# EAGLE design header (EAGLE 5.11)
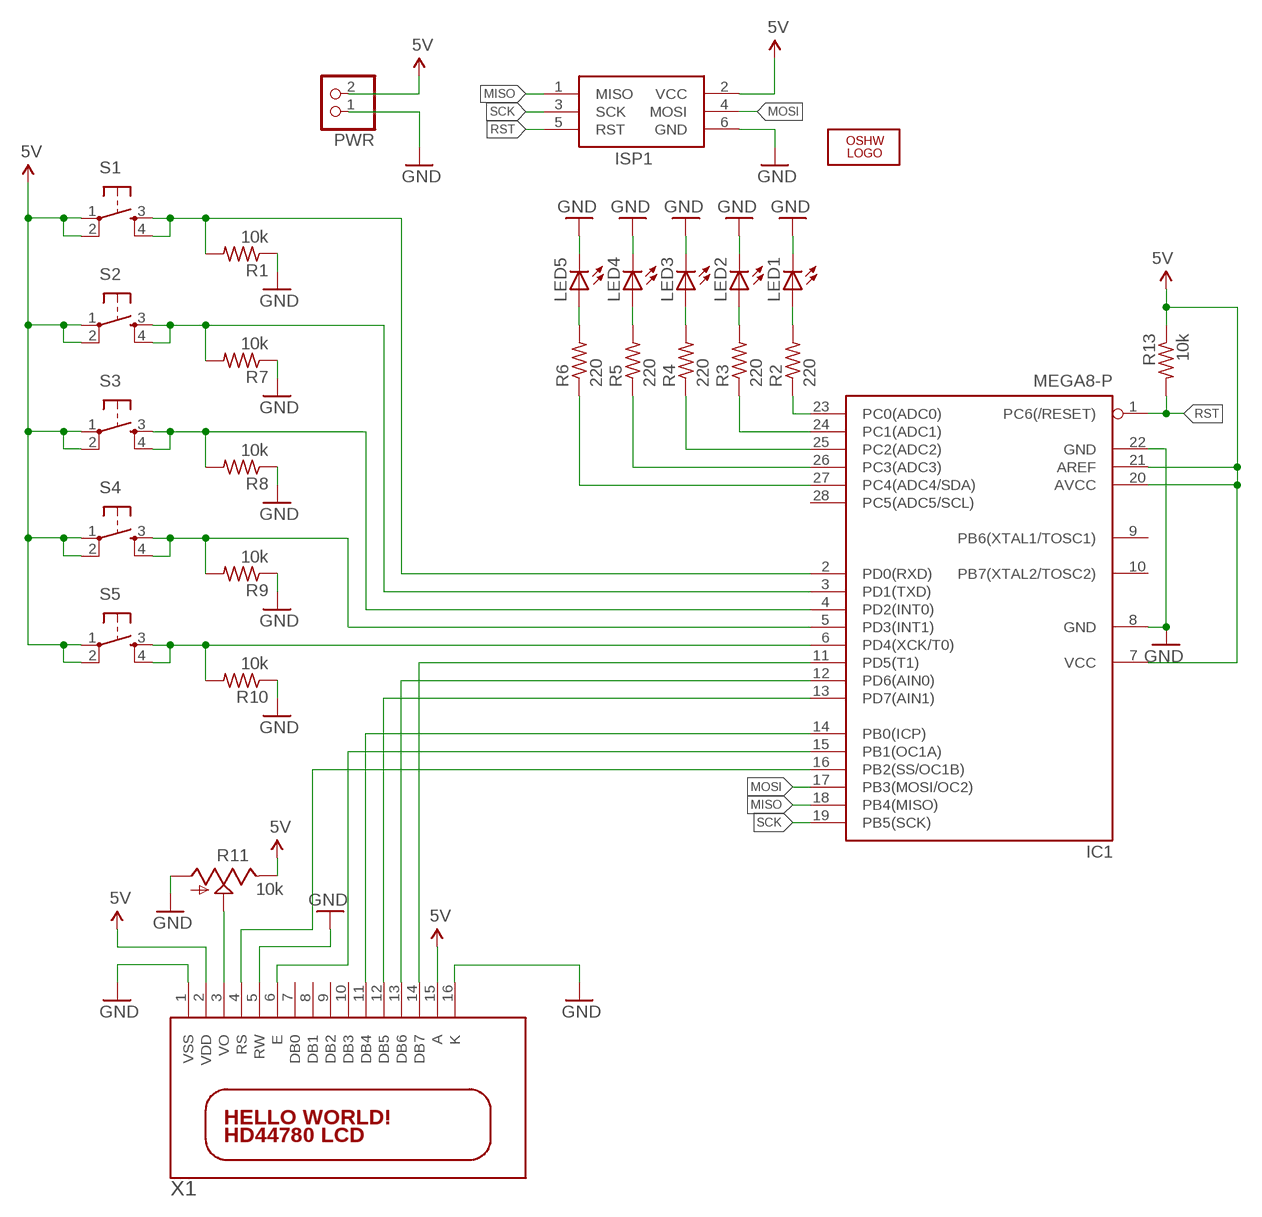
[diagram p0: schematic, sheet 1]

## Parts
IC1  MEGA8-P  [DIL28-3]
ISP1  AVRISP-6  [AVRISP]
LED1  LED5MM  [LED5MM]
LED2  LED5MM  [LED5MM]
LED3  LED5MM  [LED5MM]
LED4  LED5MM  [LED5MM]
LED5  LED5MM  [LED5MM]
LOGO1  OSHW_LOGO_10MILX0350-NT  [OSHW_10X350_NOTEXT]
PWR  PINHD-1X2/90  [1X02/90]
R1  10k  R-US_0207/7  [0207/7]
R2  220  R-US_0207/7  [0207/7]
R3  220  R-US_0207/7  [0207/7]
R4  220  R-US_0207/7  [0207/7]
R5  220  R-US_0207/7  [0207/7]
R6  220  R-US_0207/7  [0207/7]
R7  10k  R-US_0207/7  [0207/7]
R8  10k  R-US_0207/7  [0207/7]
R9  10k  R-US_0207/7  [0207/7]
R10  10k  R-US_0207/7  [0207/7]
R11  10k  TRIM_US-RS3  [RS3]
R13  10k  R-US_0207/7  [0207/7]
S1  TAC_SWITCHSMD  [TACTILE_SWITCH_SMD]
S2  TAC_SWITCHSMD  [TACTILE_SWITCH_SMD]
S3  TAC_SWITCHSMD  [TACTILE_SWITCH_SMD]
S4  TAC_SWITCHSMD  [TACTILE_SWITCH_SMD]
S5  TAC_SWITCHSMD  [TACTILE_SWITCH_SMD]
X1  HD44780LCD-1602  [LCD1602]

## Nets
5V: IC1.7(VCC) IC1.20(AVCC) IC1.21(AREF) ISP1.2(VCC) PWR.2 R11.E R13.1 S1.1 S1.2 S2.1 S2.2 S3.1 S3.2 S4.1 S4.2 S5.1 S5.2 X1.2(VDD) X1.15(A)
GND [gnd]: IC1.8(GND) IC1.22(GND) ISP1.6(GND) LED1.K(C) LED2.K(C) LED3.K(C) LED4.K(C) LED5.K(C) PWR.1 R1.1 R7.1 R8.1 R9.1 R10.1 R11.A X1.1(VSS) X1.5(RW) X1.16(K)
MISO: IC1.18(PB4(MISO)) ISP1.1(MISO)
MOSI: IC1.17(PB3(MOSI/OC2)) ISP1.4(MOSI)
N$1: IC1.2(PD0(RXD)) R1.2 S1.3 S1.4
N$2: IC1.3(PD1(TXD)) R7.2 S2.3 S2.4
N$3: IC1.4(PD2(INT0)) R8.2 S3.3 S3.4
N$4: IC1.5(PD3(INT1)) R9.2 S4.3 S4.4
N$5: IC1.6(PD4(XCK/T0)) R10.2 S5.3 S5.4
N$6: IC1.16(PB2(SS/OC1B)) X1.4(RS)
N$7: R11.S X1.3(VO)
N$8: IC1.15(PB1(OC1A)) X1.6(E)
N$9: IC1.12(PD6(AIN0)) X1.13(DB6)
N$10: IC1.13(PD7(AIN1)) X1.12(DB5)
N$11: IC1.14(PB0(ICP)) X1.11(DB4)
N$12: IC1.11(PD5(T1)) X1.14(DB7)
N$13: LED5.A R6.2
N$14: LED4.A R5.2
N$15: LED3.A R4.2
N$16: LED2.A R3.2
N$17: LED1.A R2.2
N$18: IC1.23(PC0(ADC0)) R2.1
N$19: IC1.24(PC1(ADC1)) R3.1
N$20: IC1.25(PC2(ADC2)) R4.1
N$21: IC1.26(PC3(ADC3)) R5.1
N$22: IC1.27(PC4(ADC4/SDA)) R6.1
RST: IC1.1(PC6(/RESET)) ISP1.5(RST) R13.2
SCK: IC1.19(PB5(SCK)) ISP1.3(SCK)
Unconnected: IC1.9(PB6(XTAL1/TOSC1)) IC1.10(PB7(XTAL2/TOSC2)) IC1.28(PC5(ADC5/SCL)) X1.7(DB0) X1.8(DB1) X1.9(DB2) X1.10(DB3)

## Library data of the parts
IC1 = atmel:MEGA8-P: MICROCONTROLLER 8 Kbytes FLASH, 1 kbytes SRAM, 512 bytes EEPROM, USART, 4-channel 10 bit ADC, 2-channel 8 bit ADC Pin compatible with Atmega48, ATMega88, ATMega168 Source: avr.lbr; OC_FARNELL: unknown; OC_NEWARK: unknown
ISP1 = adafruit:AVRISP: AVR ISP HEADER Standard 6 pin header for AVR programming
LED1-LED5 = adafruit:LED: LED OSRAM: - CHIPLED LG R971, LG N971, LY N971, LG Q971, LY Q971, LO R971, LY R971 LH N974, LH R974 LS Q976, LO Q976, LY Q976 LO Q996 - Hyper CHIPLED LW Q18S LB Q993, LB Q99A, LB R99A - SideLED LS A670, LO A670, LY A670, LG A670, LP A670 LB A673, LV A673, LT A673, LW A673 LH A674 LY A675 LS A676, LA A676, LO A676, LY A676, LW A676 LS A679, LY A679, LG A679 - Hyper Micro SIDELED® LS Y876, LA Y876, LO Y876, LY Y876 LT Y87S - SmartLED LW L88C, LW L88S LB L89C, LB L89S, LG L890 LS L89K, LO L89K, LY L89K LS L896, LA L896, LO L896, LY L896 - TOPLED LS T670, LO T670, LY T670, LG T670, LP T670 LSG T670, LSP T670, LSY T670, LOP T670, LYG T670 LG T671, LOG T671, LSG T671 LB T673, LV T673, LT T673, LW T673 LH T674 LS T676, LA T676, LO T676, LY T676, LB T676, LH T676, LSB T676, LW T676 LB T67C, LV T67C, LT T67C, LS T67K, LO T67K, LY T67K, LW E67C LS E67B, LA E67B, LO E67B, LY E67B, LB E67C, LV E67C, LT E67C LW T67C LS T679, LY T679, LG T679 LS T770, LO T770, LY T770, LG T770, LP T770 LB T773, LV T773, LT T773, LW T773 LH T774 LS E675, LA E675, LY E675, LS T675 LS T776, LA T776, LO T776, LY T776, LB T776 LHGB T686 LT T68C, LB T68C - Hyper Mini TOPLED® LB M676 - Mini TOPLED Santana® LG M470 LS M47K, LO M47K, LY M47K Source: http://www.osram.convergy.de/
LOGO1 = OSHW:OSHW_LOGO_10MIL
PWR = pinhead:PINHD-1X2: PIN HEADER
R1-R10 R13 = resistor:R-US_: RESISTOR, American symbol
R11 = pot:TRIM_US-: POTENTIOMETER
S1-S5 = SparkFun:TAC_SWITCH: Momentary Switch Button commonly used for reset or general input. Spark Fun Electronics SKU : COM-00097
X1 = adafruit:HD44780LCD: HD44780 LCD Standard character type LCDs, available in sizes from 8x1 to 40x4!

## Net classes
0 default: width 0.203 mm, drill 0.61 mm, clearance 0.203 mm
1 power: width 0.406 mm, drill 0.61 mm, clearance 0.203 mm
2 gnd: width 0.406 mm, drill 0.61 mm, clearance 0.203 mm
3 usbvcc: width 0.203 mm, drill 0.61 mm, clearance 0.152 mm
4 aref: width 0.203 mm, drill 0.61 mm, clearance 0.152 mm

## Board
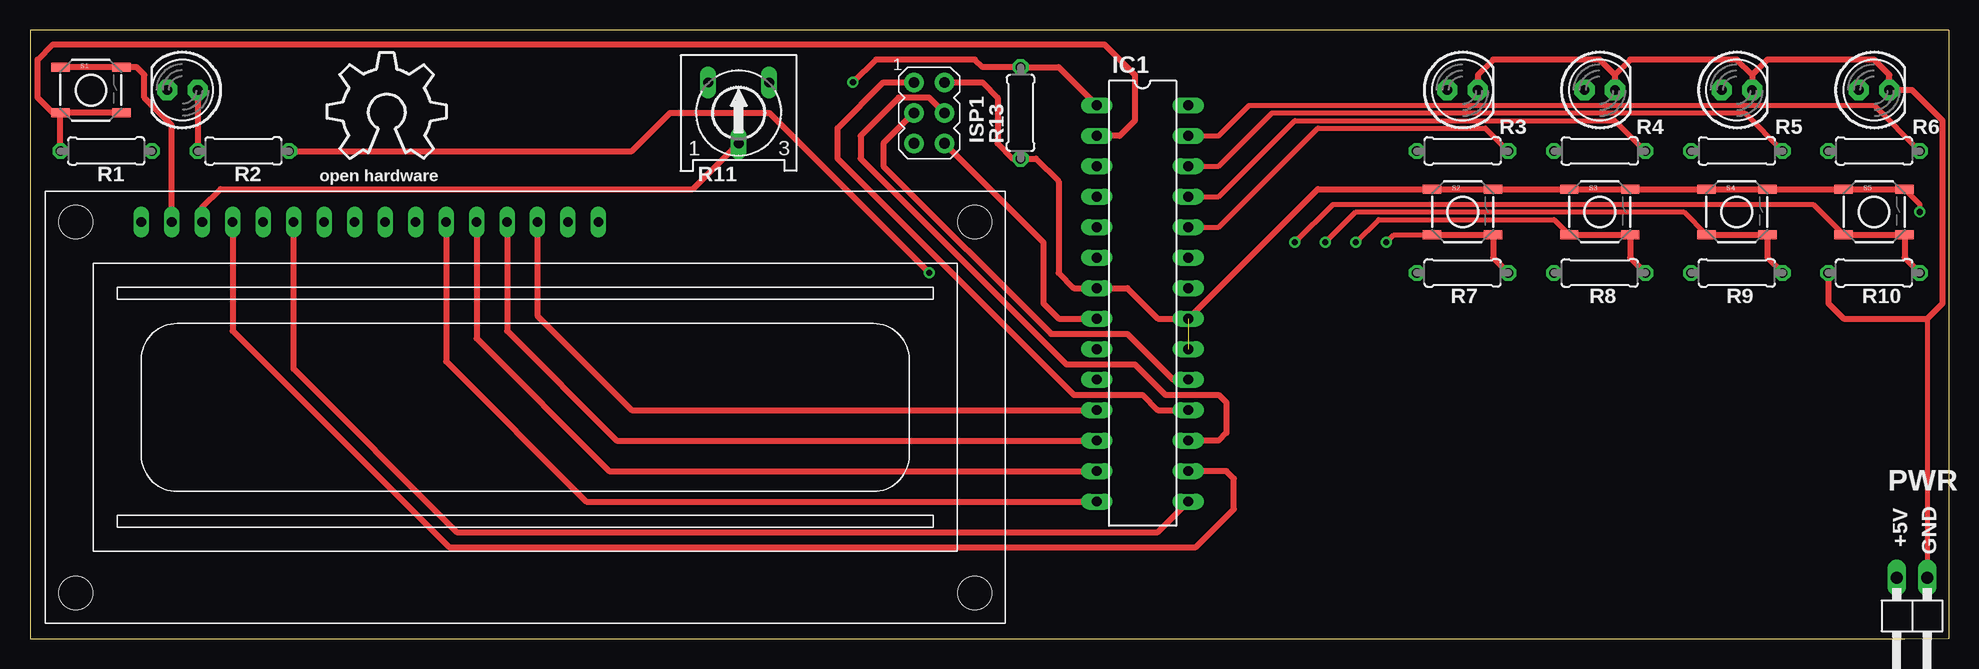
[diagram p1: board, top side]
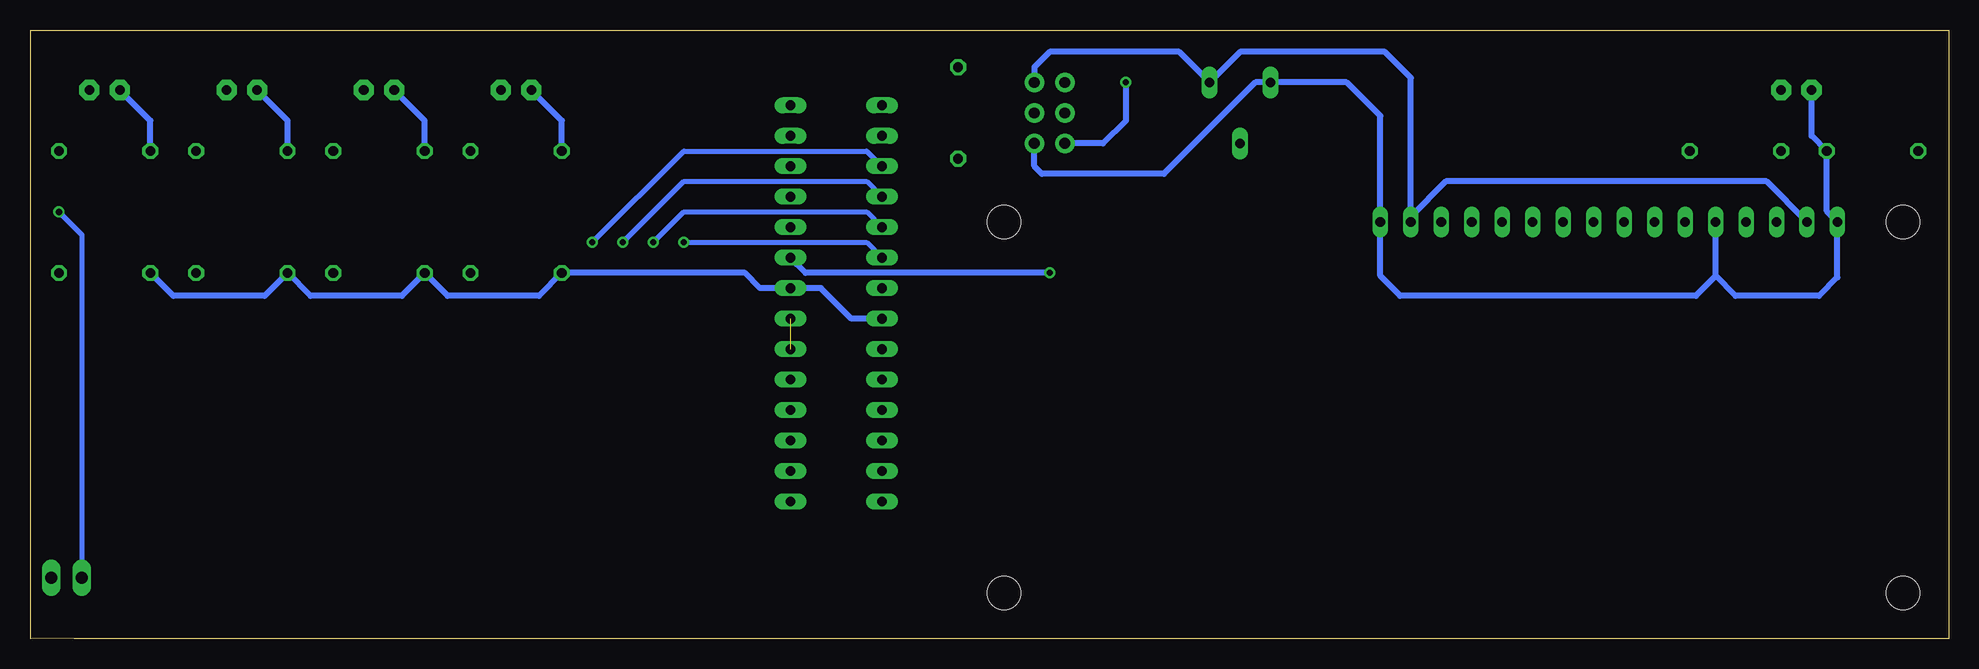
[diagram p2: board, bottom side, seen from below]

Size 159.89 x 50.72 mm. Coordinates in mm from the lower left corner, seen from the top.
Outline: 159.87,0.02 156.21,0 0,0 0,50.72 159.89,50.72 159.89,0
Copper layers (1*16): Top 0.035mm / dielectric 1.5mm / Bottom 0.035mm
Design rules "default": minimum track width 10mil, minimum drill 24mil, track to track 8mil, track to pad 8mil, pad to pad 8mil, via to via 8mil, smd to smd 8mil, copper to edge 40mil, drill to drill 8mil, minimum pad ring 10mil, minimum via ring 8mil, stop-mask expansion 4mil, vias tented up to drill 0mil, thermal gap 10mil

### Footprints (pad centres in the part's own frame; a part is rotated, then mirrored left to right if it is on the bottom)
DIL28-3 = drill 0.813 long: 1 -16.51,-3.81; 2 -13.97,-3.81; 3 -11.43,-3.81; 4 -8.89,-3.81; 5 -6.35,-3.81; 6 -3.81,-3.81; 7 -1.27,-3.81; 8 1.27,-3.81; 9 3.81,-3.81; 10 6.35,-3.81; 11 8.89,-3.81; 12 11.43,-3.81; 13 13.97,-3.81; 14 16.51,-3.81; 15 16.51,3.81; 16 13.97,3.81; 17 11.43,3.81; 18 8.89,3.81; 19 6.35,3.81; 20 3.81,3.81; 21 1.27,3.81; 22 -1.27,3.81; 23 -3.81,3.81; 24 -6.35,3.81; 25 -8.89,3.81; 26 -11.43,3.81; 27 -13.97,3.81; 28 -16.51,3.81
AVRISP = drill 0.9 pad 1.626 round: 1 -1.27,2.54; 2 1.27,2.54; 3 -1.27,0; 4 1.27,0; 5 -1.27,-2.54; 6 1.27,-2.54
LED5MM = drill 0.813 pad 1.676 octagon: A -1.27,0; K 1.27,0
1X02/90 = drill 1.016 long: 1 -1.27,-3.81; 2 1.27,-3.81
0207/7 = drill 0.813 octagon: 1 -3.81,0; 2 3.81,0
RS3 = drill 0.813 long: A -2.54,2.54; E 2.54,2.54; S 0,-2.54
TACTILE_SWITCH_SMD = smd 1.524 x 0.762: 1 -2.54,1.905; 2 2.54,1.905; 3 -2.54,-1.905; 4 2.54,-1.905
LCD1602 = drill 0.8 long: 1 8,33.46; 2 10.54,33.46; 3 13.08,33.46; 4 15.62,33.46; 5 18.16,33.46; 6 20.7,33.46; 7 23.24,33.46; 8 25.78,33.46; 9 28.32,33.46; 10 30.86,33.46; 11 33.4,33.46; 12 35.94,33.46; 13 38.48,33.46; 14 41.02,33.46; 15 43.56,33.46; 16 46.1,33.46 | hole 2.8: 2.54,2.54; 2.54,33.46; 77.46,33.46; 77.46,2.54

### Placement (x,y rotation side)
IC1  92.71,27.94 270 top
ISP1  74.93,43.81 0 top
LED1  12.7,45.72 180 top
LED2  119.38,45.72 0 top
LED3  130.81,45.72 0 top
LED4  142.24,45.72 0 top
LED5  153.67,45.72 0 top
LOGO1  24.77,40.01 0 top
PWR  156.84,1.27 180 top
R1  6.35,40.64 180 top
R2  17.78,40.64 180 top
R3  119.38,40.64 180 top
R4  130.81,40.64 180 top
R5  142.24,40.64 180 top
R6  153.67,40.64 180 top
R7  119.38,30.48 0 top
R8  130.81,30.48 0 top
R9  142.24,30.48 0 top
R10  153.67,30.48 0 top
R11  59.05,43.81 0 top
R13  82.55,43.81 90 top
S1  5.08,45.72 0 top
S2  119.38,35.56 0 top
S3  130.81,35.56 0 top
S4  142.24,35.56 0 top
S5  153.67,35.56 0 top
X1  1.27,1.27 0 top

### Tracks (layer width: path | path; a pad name or v marks a point on that pad's centre or on a via)
5V  (via drill 0.51)  (1 unrouted)
  Top 0.406: v157.48,35.56 157.48,36.2 S5.2
  Top 0.508: S5.2 S5.1 S4.2 S4.1 S3.2 S3.1 S2.2 S2.1 107.31,37.47 IC1.21 93.98,26.67 91.44,29.21 IC1.7 87,29.21 85.72,30.48 85.72,38.1 83.82,40.01 R13.1 81.92,40.01 80.64,41.27 80.64,45.09 79.38,46.35 ISP1.2 | S1.1 S1.2 8.89,47.62 9.53,46.99 9.53,45.09 11.81,42.8 X1.2
  Bottom 0.406: PWR.2 155.57,33.66 v157.48,35.56
  Bottom 0.508: ISP1.2 76.2,47.62 74.93,48.9 64.14,48.9 R11.E 59.05,48.9 46.99,48.9 44.83,46.73 X1.15 44.83,35.18 41.91,38.1 15.18,38.1 X1.2
GND
  Top 0.406: 158.12,26.67 PWR.1
  Top 0.508: 143.51,46.99 144.78,48.26 153.67,48.26 154.94,46.99 LED5.K 156.84,45.72 159.38,43.18 159.38,27.94 158.12,26.67 151.13,26.67 149.86,27.94 R10.1 | 143.51,46.99 LED4.K | 132.08,46.99 LED3.K | 132.08,46.99 133.35,48.26 142.24,48.26 143.51,46.99 | LED2.K 120.65,46.99 121.92,48.26 130.81,48.26 132.08,46.99 | ISP1.6 84.45,33.02 84.45,27.94 85.72,26.67 IC1.8
  Bottom 0.508: R10.1 147.96,28.57 140.34,28.57 R9.1 136.53,28.57 128.91,28.57 R8.1 125.09,28.57 117.47,28.57 R7.1 100.33,30.48 99.06,29.21 IC1.22 93.98,29.21 91.44,26.67 IC1.8 | LED1.K 11.43,41.91 R1.1 10.16,35.62 X1.1 9.27,30.1 10.79,28.57 17.78,28.57 19.43,30.23 | 19.43,30.23 X1.5 | 19.43,30.23 21.08,28.57 45.72,28.57 47.37,30.23 X1.16 47.37,43.56 50.16,46.35 R11.A 57.78,46.35 65.41,38.73 75.56,38.73 76.2,39.37 ISP1.6
MISO
  Top 0.508: ISP1.1 71.12,46.35 67.31,42.55 67.31,40.01 87,20.32 92.71,20.32 93.98,19.05 IC1.18
MOSI
  Top 0.508: ISP1.4 74.93,45.09 72.39,45.09 69.22,41.91 69.22,40.01 86.36,22.86 92.08,22.86 94.61,20.32 99.06,20.32 99.69,19.68 99.69,17.14 99.06,16.51 IC1.17
N$1
  Top 0.508: R1.2 S1.3 | S1.4 S1.3 | S1.3 1.91,43.81 0.64,45.09 0.64,48.26 1.91,49.53 89.53,49.53 92.08,46.99 92.08,43.18 90.81,41.91 IC1.2
N$2  (via drill 0.51)
  Top 0.406: S2.3 113.67,33.66 v113.03,33.02
  Top 0.508: R7.2 121.92,31.75 S2.4 S2.3
  Bottom 0.406: v113.03,33.02 105.41,40.64 90.17,40.64 IC1.3
N$3  (via drill 0.51)
  Top 0.406: S3.3 127,34.92 112.39,34.92 v110.49,33.02
  Top 0.508: R8.2 133.35,31.75 S3.4 S3.3
  Bottom 0.406: v110.49,33.02 105.41,38.1 90.17,38.1 IC1.4
N$4  (via drill 0.51)
  Top 0.406: S4.3 137.79,35.56 110.49,35.56 v107.95,33.02
  Top 0.508: R9.2 144.78,31.75 S4.4 S4.3
  Bottom 0.406: v107.95,33.02 105.41,35.56 90.17,35.56 IC1.5
N$5  (via drill 0.51)
  Top 0.406: S5.3 148.59,36.2 108.58,36.2 v105.41,33.02
  Top 0.508: R10.2 156.21,31.75 S5.4 S5.3
  Bottom 0.406: v105.41,33.02 90.17,33.02 IC1.6
N$6
  Top 0.508: X1.4 16.89,25.66 34.92,7.62 97.16,7.62 100.33,10.79 100.33,13.34 99.69,13.97 IC1.16
N$7
  Top 0.508: X1.3 14.35,35.94 15.88,37.47 55.24,37.47 R11.S
N$8
  Top 0.508: X1.6 21.97,22.48 35.56,8.89 93.98,8.89 IC1.15
N$9
  Top 0.508: X1.13 39.75,25.66 48.9,16.51 IC1.12
N$10
  Top 0.508: X1.12 37.21,25.02 48.26,13.97 IC1.13
N$11
  Top 0.508: X1.11 34.67,23.11 46.35,11.43 IC1.14
N$12
  Top 0.508: X1.14 42.29,26.93 50.16,19.05 IC1.11
N$13
  Bottom 0.508: LED5.A 149.86,43.18 R6.2
N$14
  Bottom 0.508: LED4.A 138.43,43.18 R5.2
N$15
  Bottom 0.508: LED3.A 127,43.18 R4.2
N$16
  Bottom 0.508: LED2.A 115.57,43.18 R3.2
N$17
  Top 0.508: LED1.A R2.2
N$18  (via drill 0.51)
  Top 0.508: R2.1 50.16,40.64 53.34,43.81 61.59,43.81 v74.93,30.48
  Bottom 0.508: v74.93,30.48 95.25,30.48 IC1.23
N$19
  Top 0.406: R3.1 121.28,42.55 107.31,42.55 99.06,34.29 IC1.24
N$20
  Top 0.406: R4.1 132.08,43.18 105.41,43.18 99.06,36.83 IC1.25
N$21
  Top 0.406: R5.1 142.88,43.81 103.5,43.81 99.06,39.37 IC1.26
N$22
  Top 0.406: R6.1 153.67,44.45 101.6,44.45 99.06,41.91 IC1.27
RST  (via drill 0.51)
  Top 0.508: IC1.1 85.72,47.62 R13.2 79.38,47.62 78.74,48.26 70.48,48.26 v68.58,46.35
  Bottom 0.508: v68.58,46.35 68.58,43.18 70.48,41.27 ISP1.5
SCK
  Top 0.508: ISP1.3 71.12,41.27 71.12,39.37 85.09,25.4 91.44,25.4 95.25,21.59 IC1.19

### Text on the board
tPlace: open hardware
tNames: +5V | GND